# Altium schematic sheet Integrated_Platform_Controller.SchDoc: 智能感知平台控制器
size A4; Organization: Altium Limited; Address1: L3, 12a Rodborough Rd; Address2: Frenchs Forest; Address3: NSW; Address4: Australia 2086; DocumentNumber: 1; Revision: V1.0; SheetNumber: 1; SheetTotal: 1
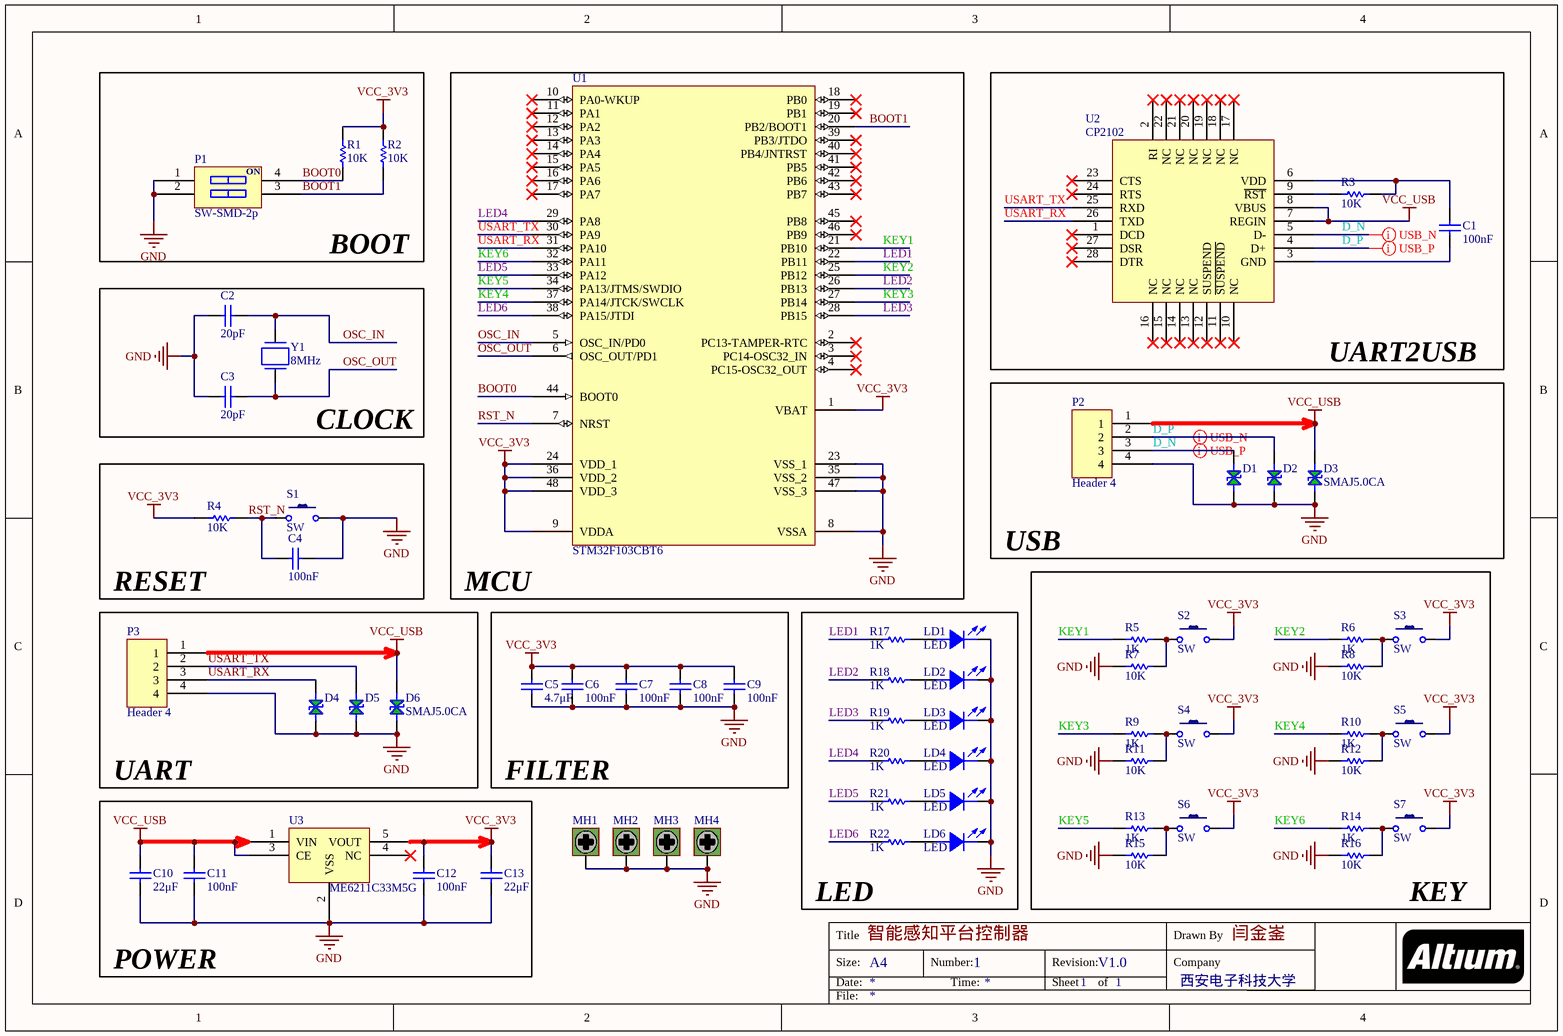
[diagram p0: Integrated_Platform_Controller.SchDoc]

## Parts
C1  100nF  [C-0603]
C2  20pF  [C-0603]
C3  20pF  [C-0603]
C4  100nF  [C-0603]
C5  4.7μF  [C-0805]
C6  100nF  [C-0603]
C7  100nF  [C-0603]
C8  100nF  [C-0603]
C9  100nF  [C-0603]
C10  22μF  [C-0805]
C11  100nF  [C-0603]
C12  100nF  [C-0603]
C13  22μF  [C-0805]
D1  SMAJ5.0CA  [SMA-DO-214AC]  (value not drawn)
D2  SMAJ5.0CA  [SMA-DO-214AC]  (value not drawn)
D3  SMAJ5.0CA  [SMA-DO-214AC]
D4  SMAJ5.0CA  [SMA-DO-214AC]  (value not drawn)
D5  SMAJ5.0CA  [SMA-DO-214AC]  (value not drawn)
D6  SMAJ5.0CA  [SMA-DO-214AC]
LD1  LED  [LED-RED-3MM]
LD2  LED  [LED-RED-3MM]
LD3  LED  [LED-RED-3MM]
LD4  LED  [LED-RED-3MM]
LD5  LED  [LED-RED-3MM]
LD6  LED  [LED-RED-3MM]
MH1  Mounting Hole 3MM  [MOUNT]  (value not drawn)
MH2  Mounting Hole 3MM  [MOUNT]  (value not drawn)
MH3  Mounting Hole 3MM  [MOUNT]  (value not drawn)
MH4  Mounting Hole 3MM  [MOUNT]  (value not drawn)
P1  SW-SMD-2p  [SW-2p-1.27mm]
P2  Header 4  [SIP4]
P3  Header 4  [SIP4]
R1  10K  [R-0603]
R2  10K  [R-0603]
R3  10K  [R-0603]
R4  10K  [R-0603]
R5  1K  [R-0603]
R6  1K  [R-0603]
R7  10K  [R-0603]
R8  10K  [R-0603]
R9  1K  [R-0603]
R10  1K  [R-0603]
R11  10K  [R-0603]
R12  10K  [R-0603]
R13  1K  [R-0603]
R14  1K  [R-0603]
R15  10K  [R-0603]
R16  10K  [R-0603]
R17  1K  [R-0603]
R18  1K  [R-0603]
R19  1K  [R-0603]
R20  1K  [R-0603]
R21  1K  [R-0603]
R22  1K  [R-0603]
S1  SW  [KEY-SMD_3X6]
S2  SW  [KEY-DIP-12X12X7.3]
S3  SW  [KEY-DIP-12X12X7.3]
S4  SW  [KEY-DIP-12X12X7.3]
S5  SW  [KEY-DIP-12X12X7.3]
S6  SW  [KEY-DIP-12X12X7.3]
S7  SW  [KEY-DIP-12X12X7.3]
U1  STM32F103CBT6  [LQFP48]
U2  CP2102  [QFN-28]
U3  ME6211C33M5G  [SOT-23-5]
Y1  8MHz  [XTAL-QC49/SMD]

## Blocks framed on the sheet
BOOT: P1 R1 R2
MCU: U1
UART2USB: C1 R3 U2
CLOCK: C2 C3 Y1
RESET: C4 R4 S1
FILTER: C5-C9
LED: LD1-LD6 R17-R22
KEY: R5-R16 S2-S7

## Nets
GND: C2.1 C3.1 C4.2 C5.1 C6.1 C7.1 C8.1 C9.1 C10.1 C11.1 C12.1 C13.1 D1.1(A) D2.1(A) D3.1(A) D4.1(A) D5.1(A) D6.1(A) LD1.2(CATHODE) LD2.2(CATHODE) LD3.2(CATHODE) LD4.2(CATHODE) LD5.2(CATHODE) LD6.2(CATHODE) MH1.1 MH2.1 MH3.1 MH4.1 P1.1 P1.2 P2.4 P3.4 R7.1(TOP) R8.1(TOP) R11.1(TOP) R12.1(TOP) R15.1(TOP) R16.1(TOP) S1.2 U1.8(VSSA) U1.23(VSS_1) U1.35(VSS_2) U1.47(VSS_3) U3.2(VSS)
VCC_3V3: C5.2 C6.2 C7.2 C8.2 C9.2 C12.2 C13.2 R1.2(BOT) R2.2(BOT) R4.1(TOP) S2.2 S3.2 S4.2 S5.2 S6.2 S7.2 U1.1(VBAT) U1.9(VDDA) U1.24(VDD_1) U1.36(VDD_2) U1.48(VDD_3) U3.5(VOUT)
VCC_USB: C10.2 C11.2 D3.2(K) D6.2(K) P2.1 P3.1 U2.7(REGIN) U2.8(VBUS) U3.1(VIN) U3.3(CE)
BOOT0: P1.4 R1.1(TOP) U1.44(BOOT0)
BOOT1: P1.3 R2.1(TOP) U1.20(PB2/BOOT1)
D_N: D1.2(K) P2.3 U2.5(D-)
D_P: D2.2(K) P2.2 U2.4(D+)
KEY1: R5.1(TOP) U1.21(PB10)
KEY2: R6.1(TOP) U1.25(PB12)
KEY3: R9.1(TOP) U1.27(PB14)
KEY4: R10.1(TOP) U1.37(PA14/JTCK/SWCLK)
KEY5: R13.1(TOP) U1.34(PA13/JTMS/SWDIO)
KEY6: R14.1(TOP) U1.32(PA11)
LED1: R17.1(TOP) U1.22(PB11)
LED2: R18.1(TOP) U1.26(PB13)
LED3: R19.1(TOP) U1.28(PB15)
LED4: R20.1(TOP) U1.29(PA8)
LED5: R21.1(TOP) U1.33(PA12)
LED6: R22.1(TOP) U1.38(PA15/JTDI)
OSC_IN: C2.2 U1.5(OSC_IN/PD0) Y1.2
OSC_OUT: C3.2 U1.6(OSC_OUT/PD1) Y1.1
RST_N: C4.1 R4.2(BOT) S1.1 U1.7(NRST)
USART_RX: D4.2(K) P3.3 U1.31(PA10) U2.26(TXD)
USART_TX: D5.2(K) P3.2 U1.30(PA9) U2.25(RXD)
NetC1_1: C1.1 U2.3(GND)
NetC1_2: C1.2 R3.2(BOT) U2.6(VDD)
NetLD1_1: LD1.1(ANODE) R17.2(BOT)
NetLD2_1: LD2.1(ANODE) R18.2(BOT)
NetLD3_1: LD3.1(ANODE) R19.2(BOT)
NetLD4_1: LD4.1(ANODE) R20.2(BOT)
NetLD5_1: LD5.1(ANODE) R21.2(BOT)
NetLD6_1: LD6.1(ANODE) R22.2(BOT)
NetR3_1: R3.1(TOP) U2.9(~{RST})
NetR5_2: R5.2(BOT) R7.2(BOT) S2.1
NetR6_2: R6.2(BOT) R8.2(BOT) S3.1
NetR9_2: R9.2(BOT) R11.2(BOT) S4.1
NetR10_2: R10.2(BOT) R12.2(BOT) S5.1
NetR13_2: R13.2(BOT) R15.2(BOT) S6.1
NetR14_2: R14.2(BOT) R16.2(BOT) S7.1

Not connected (* = marked no-connect by the designer): U1 2(PC13-TAMPER-RTC)* 3(PC14-OSC32_IN)* 4(PC15-OSC32_OUT)* 10(PA0-WKUP)* 11(PA1)* 12(PA2)* 13(PA3)* 14(PA4)* 15(PA5)* 16(PA6)* 17(PA7)* 18(PB0)* 19(PB1)* 39(PB3/JTDO)* 40(PB4/JNTRST)* 41(PB5)* 42(PB6)* 43(PB7)* 45(PB8)* 46(PB9)*; U2 1(DCD)* 2(RI)* 10(NC)* 11(~{SUSPEND})* 12(SUSPEND)* 13(NC)* 14(NC)* 15(NC)* 16(NC)* 17(NC)* 18(NC)* 19(NC)* 20(NC)* 21(NC)* 22(NC)* 23(CTS)* 24(RTS)* 27(DSR)* 28(DTR)*; U3 4(NC)*

## Layout directives
differential pair: D_N, D_P

## Notes on the sheet
- USB
- UART
- POWER
- Title
- Size:
- Date:
- A4
- Number:
- Time:
- Revision:
- Sheet
- of
- Drawn By
- Company
- 西安电子科技大学
- 闫金崟
- File:
- (in symbol SW-SMD-2p) ON

## Library data of the parts
C1 C4 C6-C9 C11 C12 = CAP: Capacitor; Published: 8-Jun-2000; LatestRevisionDate: 17-Jul-2002; LatestRevisionNote: Re-released for DXP Platform.; PackageReference: RAD-0.3; Publisher: Altium Limited; PackageDescription: Radial Cap, Thru-Hole; 2 Leads; 0.3 in Pin Spacing; Value: 100nF
C2 C3 C5 C10 C13 = CAP: Capacitor; Value: 100nF; Published: 8-Jun-2000; LatestRevisionDate: 17-Jul-2002; LatestRevisionNote: Re-released for DXP Platform.; PackageReference: RAD-0.3; Publisher: Altium Limited; PackageDescription: Radial Cap, Thru-Hole; 2 Leads; 0.3 in Pin Spacing
D1-D6 = TVS
P1 = SW-SMD-2p: SW-SMT-2p
R1-R4 R7 R8 R11 R12 R15 R16 = RES: Potentiometer; Sim Note: Enter the Resistance value and the set point into parameter fields.; Set Position: 0.5; Value: 1K; Published: 8-Jun-2000; LatestRevisionDate: 17-Jul-2002; LatestRevisionNote: Re-released for DXP Platform.; PackageReference: VR5; Publisher: Altium Limited; PackageDescription: Variable Resistor, Thru-Hole; 3 Leads
R5 R6 R9 R10 R13 R14 R17-R22 = RES: Potentiometer; Sim Note: Enter the Resistance value and the set point into parameter fields.; Set Position: 0.5; Published: 8-Jun-2000; LatestRevisionDate: 17-Jul-2002; LatestRevisionNote: Re-released for DXP Platform.; PackageReference: VR5; Publisher: Altium Limited; PackageDescription: Variable Resistor, Thru-Hole; 3 Leads; Value: 1K
S1-S7 = KEY
U1 = STM32F103CBT6: STM32 ARM-based 32-bit MCU with 128 Kbytes Flash, 48-pin LQFP, Industrial Temperature
U3 = ME6211H/C
Y1 = XTAL: CRYSTAL; value: 11.0592M